# EAGLE design FootSensorV1 (EAGLE 6.5.0)
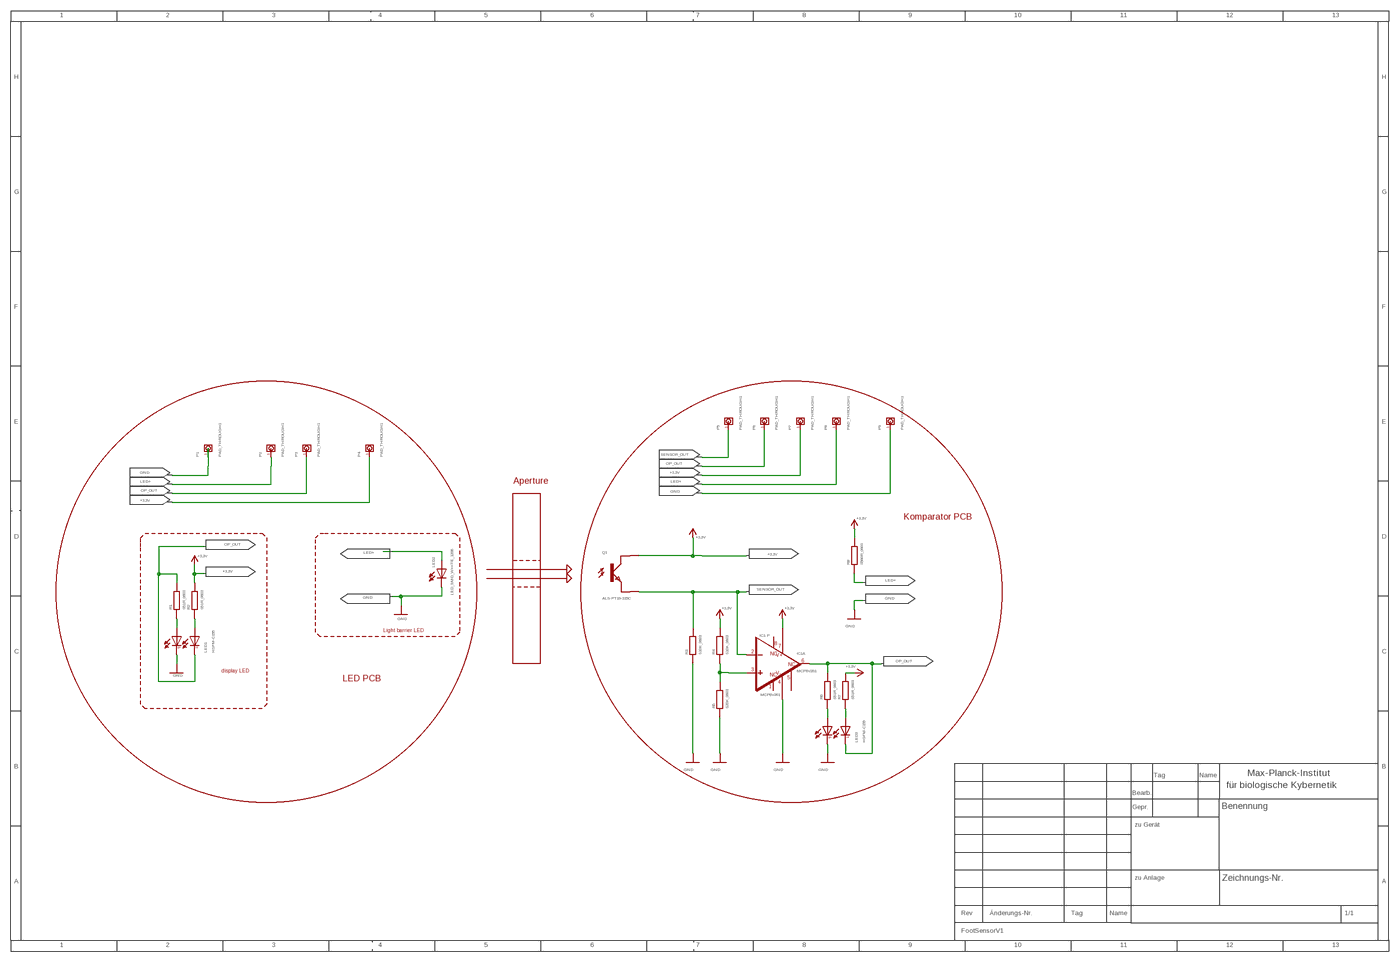
[diagram p0: schematic, sheet 1, overview]
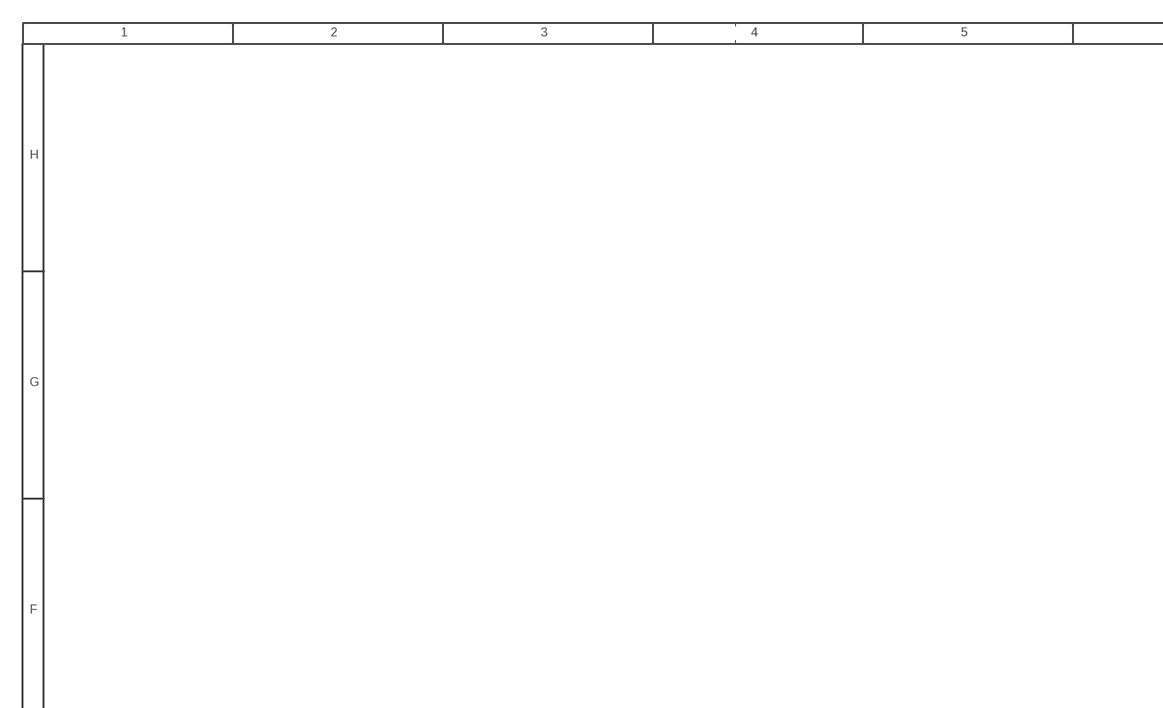
[diagram p1: schematic, sheet 1, part 1 of 4]
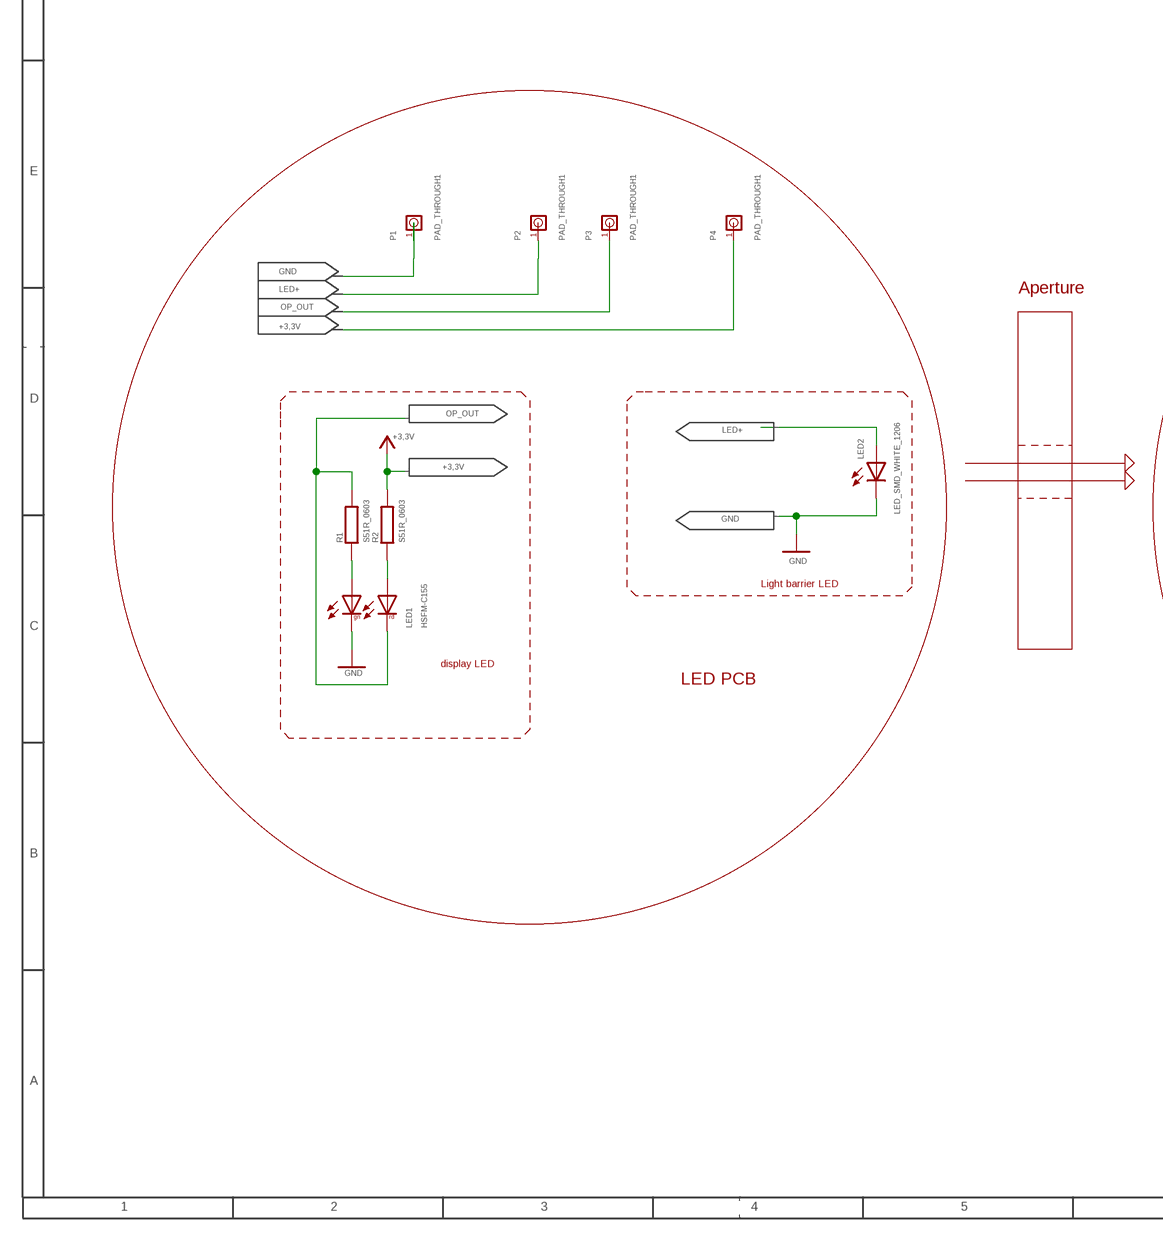
[diagram p2: schematic, sheet 1, part 2 of 4]
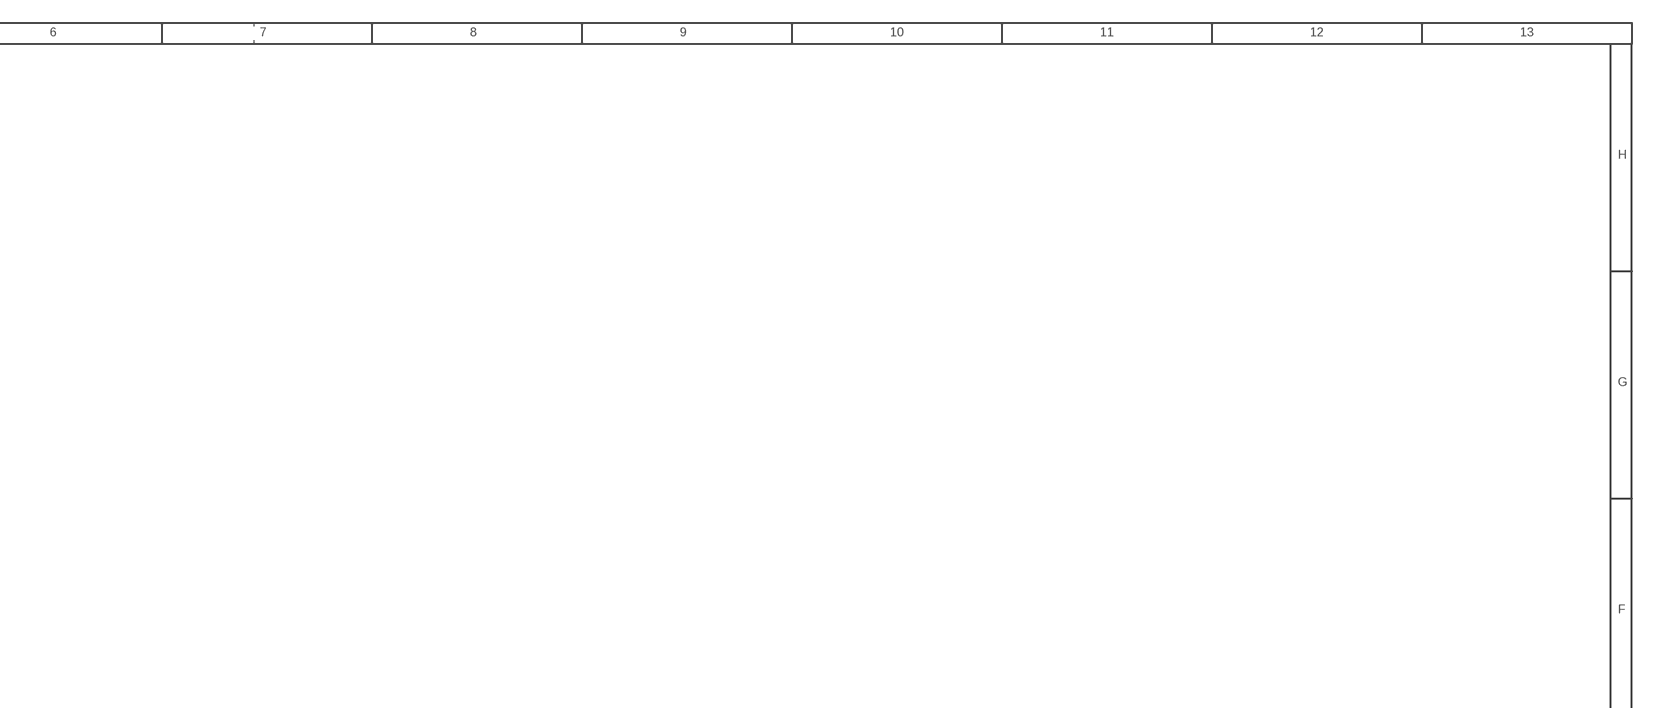
[diagram p3: schematic, sheet 1, part 3 of 4]
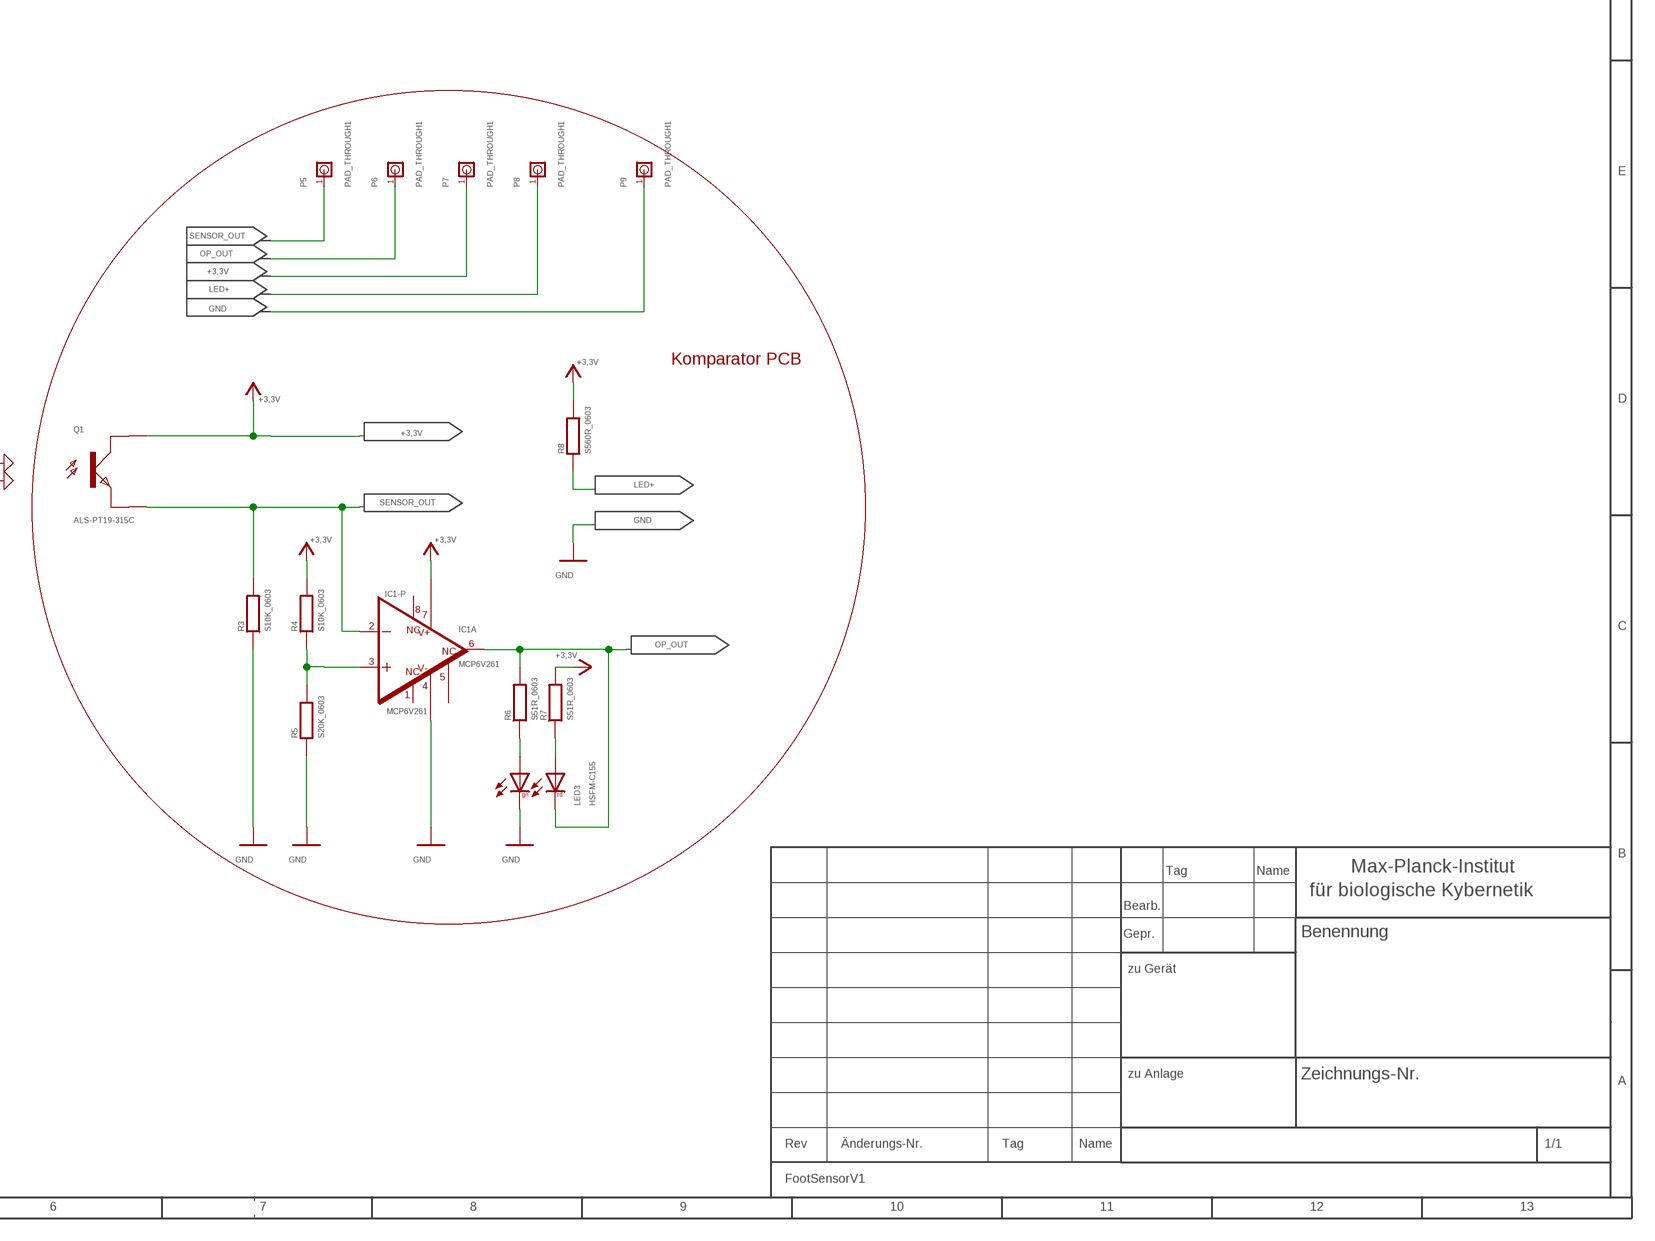
[diagram p4: schematic, sheet 1, part 4 of 4]

## Parts
IC1  MCP6V261  [MSOP8]
LED1  HSFM-C155  [3225]
LED2  LED_SMD_WHITE_1206  [1206C]
LED3  HSFM-C155  [3225]
P1  PAD_THROUGH1  [PAD_TH_056X055]
P2  PAD_THROUGH1  [PAD_TH_056X055]
P3  PAD_THROUGH1  [PAD_TH_056X055]
P4  PAD_THROUGH1  [PAD_TH_056X055]
P5  PAD_THROUGH1  [PAD_TH_056X055]
P6  PAD_THROUGH1  [PAD_TH_056X055]
P7  PAD_THROUGH1  [PAD_TH_056X055]
P8  PAD_THROUGH1  [PAD_TH_056X055]
P9  PAD_THROUGH1  [PAD_TH_056X055]
Q1  ALS-PT19-315C  [FOTOTRANSISTOR]
R1  S51R_0603  [0603R]
R2  S51R_0603  [0603R]
R3  S10K_0603  [0603R]
R4  S10K_0603  [0603R]
R5  S20K_0603  [0603R]
R6  S51R_0603  [0603R]
R7  S51R_0603  [0603R]
R8  S560R_0603  [0603R]

## Nets
+3,3V: IC1.7 P4.P$1 P7.P$1 Q1.1(C) R2.P$2 R4.P$2 R7.P$2 R8.P$2
GND: IC1.4 LED1.2 LED2.-(C1) LED3.2 P1.P$1 P9.P$1 R3.P$1 R5.P$1
LED+: LED2.+(A1) P2.P$1 P8.P$1 R8.P$1
N$1: IC1.3 R4.P$1 R5.P$2
N$3: LED3.1 R6.P$1
N$5: LED3.3 R7.P$1
N$7: LED1.1 R1.P$1
N$8: LED1.3 R2.P$1
OP_OUT: IC1.6 LED1.4 LED3.4 P3.P$1 P6.P$1 R1.P$2 R6.P$2
SENSOR_OUT: IC1.2 P5.P$1 Q1.2(E) R3.P$2
Unconnected: IC1.1 IC1.5 IC1.8

## Notes on the sheet
- Aperture
- Komparator PCB
- Light barrier LED
- display LED
- LED PCB

## Library data of the parts
IC1 = joshi:MCP6V26: SMD OP Amp rail-to-rail part number: MCP6V26-E/MS RS order code: 755-9568 package: MSOP-8 manufacturer: MICROCHIP
LED1 LED3 = joshi:HSFM-C155: SMD dual LED red/green 20mA 2,1V part number: HSMF-C155 Farnell order code: 5790888 package: 3225 manufacturer: AVAGO
LED2 = OPTO_Display:LED_SMD_WHITE_1206: SMD LED White 20mA 3V part number: 158301260 Farnell order code: 2470224 package: 1206 manufacturer: WURTH ELEKTRONIK
P1-P9 = Connectors:PAD_THROUGH: 000000; 000,00; Solder Pad PAD_01 Diameter=56mil, Drill=0.55mm
Q1 = joshi:ALS-PT19-315C: SMD phototransistor part number: ALS-PT19-315C/L177/TR8 Digi-key order code: 1080-1244-1-ND package: 2-SMD manufacturer: EVERLIGHT
R1 R2 R6 R7 = joshi:S51R_0603: SMD resistor 51Ohm part number: MCT06030C5109FP500 Farnell order code: 2614454 package: 0603 manufacturer: VISHAY
R3 R4 = joshi:S10K_0603: SMD resistor 10kOhm part number: RN73C1J10KBTDF Farnell order code: 2613718 package: 0603 manufacturer: TE CONNECTIVITY
R5 = joshi:S20K_0603: SMD resistor 20kOhm part number: CRCW060320K0FKEA Farnell order code: 1469774 package: 0603 manufacturer: VISHAY
R8 = joshi:S560R_0603: SMD resistor 560Ohm part number: WR06X5600FTL Farnell order code: 2502470 package: 0603 manufacturer: WALSIN

## Board
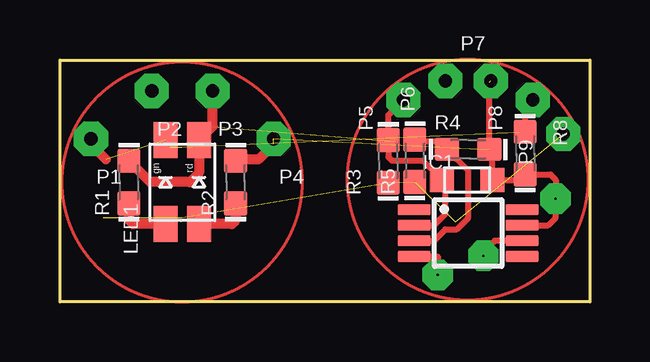
[diagram p5: board, top side]
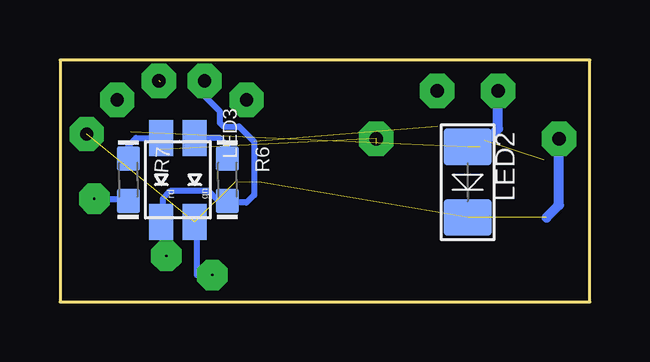
[diagram p6: board, bottom side, seen from below]

Size 22.1 x 10.1 mm. Coordinates in mm from the lower left corner, seen from the top.
Outline: 0,10.1 22.1,10.1 22.1,0 0,0 0,10.1
Copper layers (1*16): Top 0.035mm / dielectric 1.5mm / Bottom 0.035mm
Design rules "default *": minimum track width 10mil, minimum drill 24mil, track to track 8mil, track to pad 8mil, pad to pad 8mil, via to via 8mil, smd to smd 8mil, copper to edge 0mil, drill to drill 8mil, minimum pad ring 10mil, minimum via ring 8mil, stop-mask expansion 4mil, vias tented up to drill 10mil, thermal gap 10mil

### Footprints (pad centres in the part's own frame; a part is rotated, then mirrored left to right if it is on the bottom)
MSOP8 = smd 0.45 x 1.4: 1 -0.975,-2.25; 2 -0.325,-2.25; 3 0.325,-2.25; 4 0.975,-2.25; 5 0.975,2.25; 6 0.325,2.25; 7 -0.325,2.25; 8 -0.975,2.25
3225 = smd 1.5 x 1: 1 -1.75,0.7; 2 1.75,0.7; 3 -1.75,-0.7; 4 1.75,-0.7
1206C = smd 1.524 x 1.981: + -1.473,0; - 1.473,0
PAD_TH_056X055 = drill 0.55 pad 1.422 octagon: P$1 0,0
FOTOTRANSISTOR = smd 1 x 1: 1 -1.05,0; 2 1.05,0
0603R = smd 1.016 x 0.965: P$1 -0.889,0; P$2 0.889,0

### Placement (x,y rotation side)
IC1  17.02,2.88 270 top
LED1  5.1,5 90 top
LED2  5.1,5 270 bottom
LED3  17.18,5.1 270 bottom
P1  1.29,6.81 180 top
P2  3.83,8.81 180 top
P3  6.37,8.81 180 top
P4  8.91,6.81 180 top
P5  14.32,8.43 90 top
P6  16.07,9.23 90 top
P7  17.97,9.23 0 top
P8  19.72,8.43 90 top
P9  20.99,7.01 90 top
Q1  16.98,5.1 180 top
R1  2.88,5 90 top
R2  7.32,5 90 top
R3  13.69,5.87 90 top
R4  17.02,6.37 0 top
R5  14.8,5.89 90 top
R6  15.12,5.1 270 bottom
R7  19.24,5.1 270 bottom
R8  19.4,6.21 270 top

### Tracks (layer width: path | path; a pad name or v marks a point on that pad's centre or on a via)
+3,3V  (via drill 0.1 pad 1.27)  (3 unrouted)
  Top 0.254: IC1.7 20.36,3.2 20.67,3.51 v20.67,4.31 20.67,5.1 20.45,5.32 R8.P$2 19.18,5.1 Q1.1 18.03,6.25 R4.P$2 17.91,9.16
  Top 0.406: 8.91,6.59 8.28,5.95 7.07,5.95 R2.P$2
  Bottom 0.254: v20.67,4.31 19.34,4.31 R7.P$2
GND  (via drill 0.1 pad 1.27)  (6 unrouted)
  Top 0.254: IC1.4 15.75,1.9 v15.75,1.13
  Top 0.406: P1.P$1 1.29,6.59 1.93,5.95
  Bottom 0.254: v15.75,1.13 16.39,1.13 16.39,3.26 LED3.2
  Bottom 0.406: 1.81,3.53 1.29,4.05 P1.P$1
LED+  (2 unrouted)
  Top 0.254: 19.15,7.1 R8.P$1 19.4,8.12 P8.P$1
  Bottom 0.406: 4.58,6.47 3.83,7.22 P2.P$1
N$1
  Top 0.254: IC1.3 15.59,2.55 16.07,3.04 16.55,3.04 17.02,3.51 17.02,5.48 R4.P$1 16.13,6.46 15.91,6.69 14.89,6.69 R5.P$2
N$3
  Bottom 0.254: R6.P$1 15.12,6.53 15.43,6.85 LED3.1
N$5
  Bottom 0.254: R7.P$1 19.24,6.53 18.93,6.85 LED3.3
N$7
  Top 0.406: LED1.1 3.04,3.25 2.88,3.41 R1.P$1
N$8
  Top 0.406: R2.P$1 7.32,3.41 7.16,3.25 LED1.3
OP_OUT  (via drill 0.1 pad 1.27)  (1 unrouted)
  Top 0.254: IC1.6 18.12,2.55 17.97,2.4 v17.66,1.93
  Top 0.406: R1.P$2 3.77,5 5.42,5 5.8,5.38 LED1.4 6.37,7.32 P3.P$1
  Bottom 0.254: v17.66,1.93 17.82,1.93 17.82,2.88 17.97,3.26 LED3.4 17.82,3.42 17.82,4.31 17.5,4.62 15.91,4.62 15.5,4.21 R6.P$2 15.05,4.15 14.32,4.15 14.01,4.47 14.01,6.69 14.64,7.32 15.28,7.32 15.43,7.48 15.43,7.96 16.07,8.59 P6.P$1
SENSOR_OUT
  Top 0.254: IC1.2 15.6,3.2 16.07,3.67 16.07,4.96 Q1.2 15.14,5.89 13.85,5.89 13.69,6.05 R3.P$2 13.69,7.8 P5.P$1
(copper drawn outside any net)
  shapes: Top circle x2